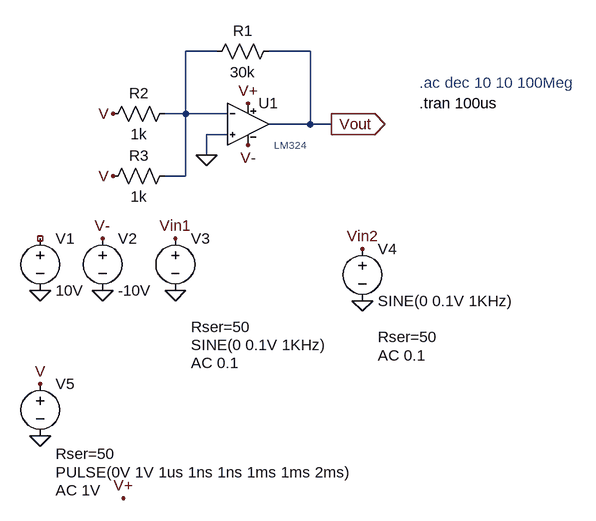
[diagram p0: schematic Lab2Circuit1.asc]
Lab2Circuit1.asc, the LTspice schematic file:
Version 4.1
SHEET 1 880 748
WIRE 160 16 112 16
WIRE 304 16 240 16
WIRE 112 112 112 16
WIRE 112 112 80 112
WIRE 176 112 112 112
WIRE 304 128 304 16
WIRE 304 128 240 128
WIRE 336 128 304 128
WIRE 176 144 144 144
WIRE 144 176 144 144
WIRE 112 208 112 112
WIRE 112 208 80 208
FLAG 336 128 Vout
IOPIN 336 128 Out
FLAG 16 704 V+
FLAG -16 304 V-
FLAG 96 304 Vin1
FLAG 384 320 Vin2
FLAG 208 160 V-
FLAG 208 96 V+
FLAG 384 400 0
FLAG -16 384 0
FLAG 96 384 0
FLAG -112 384 0
FLAG 144 176 0
FLAG -112 528 V
FLAG 0 112 V
FLAG 0 208 V
FLAG -112 608 0
SYMBOL LM324 208 128 R0
SYMATTR InstName U1
SYMBOL res 256 0 R90
WINDOW 0 0 56 VBottom 2
WINDOW 3 32 56 VTop 2
SYMATTR InstName R1
SYMATTR Value 30k
SYMBOL res 96 96 R90
WINDOW 0 0 56 VBottom 2
WINDOW 3 32 56 VTop 2
SYMATTR InstName R2
SYMATTR Value 1k
SYMBOL res 96 192 R90
WINDOW 0 0 56 VBottom 2
WINDOW 3 32 56 VTop 2
SYMATTR InstName R3
SYMATTR Value 1k
SYMBOL voltage -112 288 R0
SYMATTR InstName V1
SYMATTR Value 10V
SYMBOL voltage -16 288 R0
WINDOW 123 0 0 Left 0
WINDOW 39 0 0 Left 0
SYMATTR InstName V2
SYMATTR Value -10V
SYMBOL voltage 96 288 R0
WINDOW 3 24 180 Left 2
WINDOW 123 24 208 Left 2
WINDOW 39 24 152 Left 2
SYMATTR Value SINE(0 0.1V 1KHz)
SYMATTR Value2 AC 0.1
SYMATTR SpiceLine Rser=50
SYMATTR InstName V3
SYMBOL voltage 384 304 R0
WINDOW 123 24 180 Left 2
WINDOW 39 24 152 Left 2
SYMATTR Value2 AC 0.1
SYMATTR SpiceLine Rser=50
SYMATTR InstName V4
SYMATTR Value SINE(0 0.1V 1KHz)
SYMBOL voltage -112 512 R0
WINDOW 3 24 152 Left 2
WINDOW 123 24 180 Left 2
WINDOW 39 24 124 Left 2
SYMATTR InstName V5
SYMATTR Value PULSE(0V 1V 1us 1ns 1ns 1ms 1ms 2ms)
SYMATTR Value2 AC 1V
SYMATTR SpiceLine Rser=50
TEXT 472 96 Left 2 !.tran 100us
TEXT 472 64 Left 2 ;.ac dec 10 10 100Meg
TEXT 248 160 Left 1 ;LM324

The netlist it stands for:
* Lab2Circuit1.asc
X§U1 0 N001 V+ V- Vout LM324  ; pins In+ In- V+ V- OUT
R1 Vout N001 30k
R2 N001 V 1k
R3 N001 V 1k
V1 NC_01 0 10V
V2 V- 0 -10V
V3 Vin1 0 SINE(0 0.1V 1KHz) AC 0.1 Rser=50
V4 Vin2 0 SINE(0 0.1V 1KHz) AC 0.1 Rser=50
V5 V 0 PULSE(0V 1V 1us 1ns 1ns 1ms 1ms 2ms) AC 1V Rser=50
.tran 100us
* .ac dec 10 10 100Meg
* LM324
.lib C:\Users\ivan_\OneDrive\Desktop\LM324.lib.txt
.backanno
.end